# EAGLE design rocket-logger-basic (EAGLE 6.5.0)
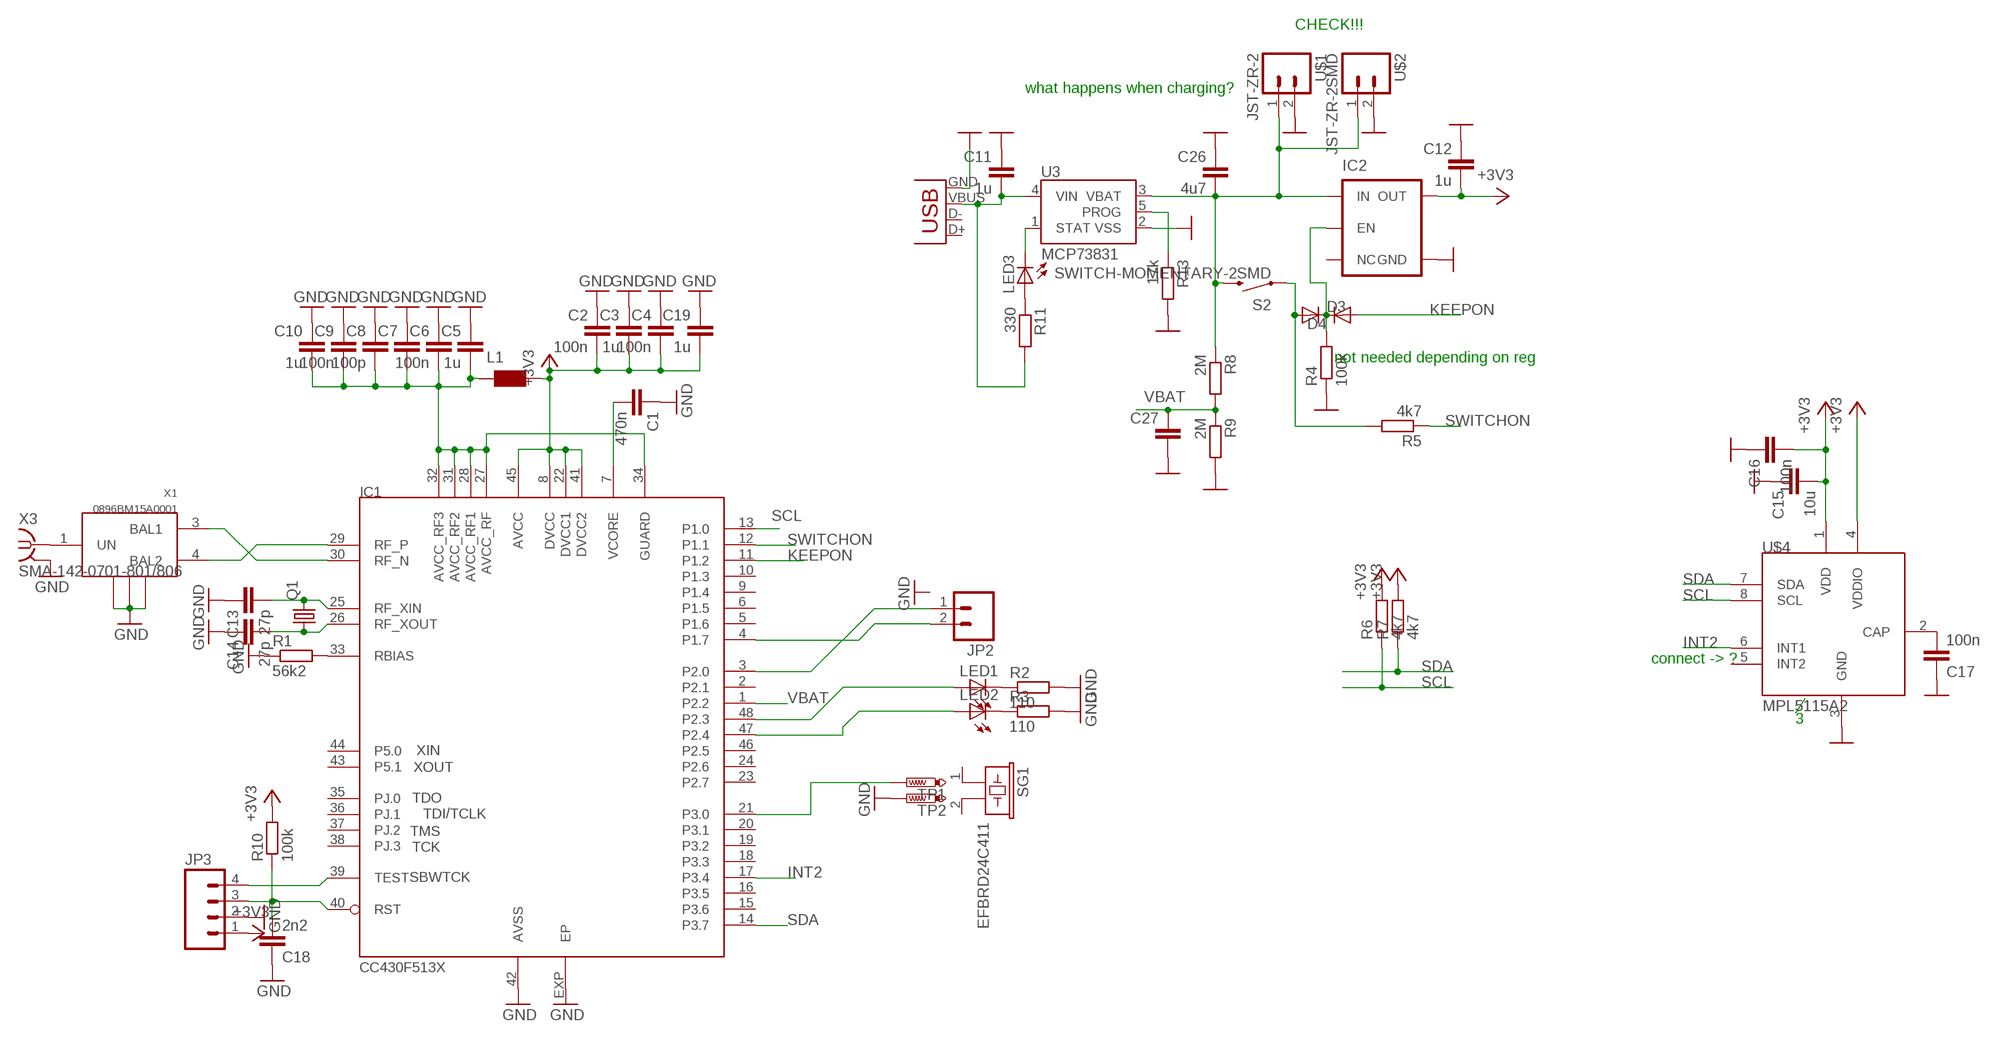
[diagram p0: schematic, sheet 1]

## Parts
C1  470n  C-EUC0402  [C0402]
C2  100n  C-EUC0402  [C0402]
C3  1u  C-EUC0402  [C0402]
C4  100n  C-EUC0402  [C0402]
C5  1u  C-EUC0402  [C0402]
C6  100n  C-EUC0402  [C0402]
C7  C-EUC0402  [C0402]
C8  100p  C-EUC0402  [C0402]
C9  100n  C-EUC0402  [C0402]
C10  1u  C-EUC0402  [C0402]
C11  1u  C-EUC0402  [C0402]
C12  1u  C-EUC0402  [C0402]
C13  27p  C-EUC0402  [C0402]
C14  27p  C-EUC0402  [C0402]
C15  10u  C-EUC0402  [C0402]
C16  100n  C-EUC0402  [C0402]
C17  100n  C-EUC0402  [C0402]
C18  2n2  C-EUC0402  [C0402]
C19  1u  C-EUC0402  [C0402]
C26  4u7  C-EUC0402  [C0402]
C27  C-EUC0402  [C0402]
D3  DIODE-SOD523  [SOD523]
D4  DIODE-SOD523  [SOD523]
IC1  CC430F513X  [QFN48]
IC2  V_REG_TPS76433SOT23-5  [SOT23-5]
JP2  M02PTH  [1X02]
JP3  M04PTH  [1X04]
L1  WE-MK_0603  [0603]
LED1  LED0603  [LED-0603]
LED2  LED0603  [LED-0603]
LED3  LED0603  [LED-0603]
Q1  CRYSTAL5X3  [CRYSTAL-SMD-5X3]
R1  56k2  R-EU_R0402  [R0402]
R2  110  R-EU_R0402  [R0402]
R3  110  R-EU_R0402  [R0402]
R4  100k  R-EU_R0402  [R0402]
R5  4k7  R-EU_R0402  [R0402]
R6  4k7  R-EU_R0402  [R0402]
R7  4k7  R-EU_R0402  [R0402]
R8  2M  R-EU_R0402  [R0402]
R9  2M  R-EU_R0402  [R0402]
R10  100k  R-EU_R0402  [R0402]
R11  330  R-EU_R0402  [R0402]
R13  17k  R-EU_R0402  [R0402]
S2  SWITCH-MOMENTARY-2SMD  [TACTILE_SWITCH_SMD]
SG1  EFBRD24C411  [EFBRD24C411]
TP1  PTR1B1,27  [B1,27]
TP2  PTR1B1,27  [B1,27]
U3  MCP73831  [SOT23-5]
U$1  JST-ZR-2  [JST-ZR-2]
U$2  JST-ZR-2SMD  [JST-ZR-2-SMD]
U$4  MPL5115A2  [LGA8]
X1  0896BM15A0001  [0896BM15A0001]
X2  USB-MICROB  [USB-MICROB]
X3  SMA-142-0701-801/806  [J502-ND-142-0701-801/806]

## Nets
+3V3: C2.2 C3.2 C4.2 C12.2 C15.2 C16.2 C19.2 IC1.8(DVCC) IC1.22(DVCC1) IC1.41(DVCC2) IC1.45(AVCC) IC2.5(OUT) JP3.1 L1.2 R6.2 R7.2 R10.2 U$4.1(VDD) U$4.4(VDDIO)
AVCC_RF2: C5.2 C6.2 C7.2 C8.2 C9.2 C10.2 IC1.27(AVCC_RF) IC1.28(AVCC_RF1) IC1.31(AVCC_RF2) IC1.32(AVCC_RF3) IC1.34(GUARD) L1.1
GND: C1.1 C2.1 C3.1 C4.1 C5.1 C6.1 C7.1 C8.1 C9.1 C10.1 C11.1 C12.1 C13.1 C14.1 C15.1 C16.1 C17.1 C18.1 C19.1 C26.1 C27.2 IC1.42(AVSS) IC1.EXP(EP) IC2.2(GND) JP3.2 R1.1 R2.2 R3.2 R4.1 R9.2 R13.2 TP2.TP U3.2(VSS) U$1.2 U$2.2 U$4.3(GND) X1.2(GND2) X1.5(GND) X1.6(GND1) X2.GND X3.G@1(GND)
INT2: IC1.17(P3.4) U$4.6(INT1)
KEEPON: D4.A IC1.11(P1.2)
N$1: R13.1 U3.5(PROG)
N$2: C26.2 IC2.1(IN) R8.1 S2.3 U3.3(VBAT) U$1.1 U$2.1
N$3: IC1.30(RF_N) X1.3(BAL1)
N$4: IC1.29(RF_P) X1.4(BAL2)
N$5: IC1.33(RBIAS) R1.2
N$6: C13.2 IC1.25(RF_XIN) Q1.3
N$7: C14.2 IC1.26(RF_XOUT) Q1.1
N$8: X1.1(UN) X3.1
N$9: LED1.C R2.1
N$10: LED2.C R3.1
N$11: IC1.3(P2.0) JP2.1
N$12: IC1.4(P1.7) JP2.2
N$13: C17.2 U$4.2(CAP)
N$15: LED3.A R11.1
N$16: IC1.48(P2.3) LED1.A
N$18: C11.2 R11.2 U3.4(VIN) X2.VBUS
N$19: LED3.C U3.1(STAT)
N$23: IC1.39(TEST) JP3.4
N$24: D3.A R5.2 S2.1
N$25: D3.C D4.C IC2.3(EN) R4.2
N$26: C18.2 IC1.40(RST) JP3.3 R10.1
N$28: IC1.47(P2.4) LED2.A
N$29: IC1.21(P3.0) TP1.TP
SCL: IC1.13(P1.0) R6.1 U$4.8(SCL)
SDA: IC1.14(P3.7) R7.1 U$4.7(SDA)
SWITCHON: IC1.12(P1.1) R5.1
VBAT: C27.1 IC1.1(P2.2) R8.2 R9.1
VCORE: C1.2 IC1.7(VCORE)
Unconnected: IC1.2(P2.1) IC1.5(P1.6) IC1.6(P1.5) IC1.9(P1.4) IC1.10(P1.3) IC1.15(P3.6) IC1.16(P3.5) IC1.18(P3.3) IC1.19(P3.2) IC1.20(P3.1) IC1.23(P2.7) IC1.24(P2.6) IC1.35(PJ.0) IC1.36(PJ.1) IC1.37(PJ.2) IC1.38(PJ.3) IC1.43(P5.1) IC1.44(P5.0) IC1.46(P2.5) IC2.4(NC) SG1.1 SG1.2 U$4.5(INT2) X2.D+ X2.D-

## Notes on the sheet
- CHECK!!!
- what happens when charging?
- not needed depending on reg
- connect -> ?
- 3

## Power pins joined to a net without a drawn wire
GND: X3.G@2(GND) X3.G@3(GND) X3.G@4(GND)

## Library data of the parts
C1-C19 C26 C27 = resistor:C-EU: CAPACITOR, European symbol
D3 D4 = diode:DIODE-: DIODE
IC1 = Mine:CC430F513X
IC2 = SparkFun:V_REG_TPS76433: Voltage Regulator Older TI part. LDO 150mA regulator. No output by-pass cap option. See V_REG_LDO for a better part.
JP2 = SparkFun:M02: Header 2 Standard 2-pin 0.1" header. Use with straight break away headers (SKU : PRT-00116), right angle break away headers (PRT-00553), swiss pins (PRT-00743), machine pins (PRT-00117), and female headers (PRT-00115). Molex polarized connector foot print use with SKU : PRT-08233 with associated crimp pins and housings.
JP3 = SparkFun:M04: Header 4 Standard 4-pin 0.1" header. Use with straight break away headers (SKU : PRT-00116), right angle break away headers (PRT-00553), swiss pins (PRT-00743), machine pins (PRT-00117), and female headers (PRT-00115). Molex polarized connector foot print use with SKU : PRT-08231 with associated crimp pins and housings.
L1 = wuerth-elektronik:WE-MK: SMD Multilayer Ceramic Inductors WE-MK - Windings printed on ceramic substrate - Extremely high SRF > 15 GHz - Inductance is stable over temperature -- High frequency circuits -- Bluetooth -- Wireless LAN -- Filter circuits
LED1-LED3 = SparkFun:LED: LEDs Standard schematic elements and footprints for 5mm, 3mm, 1206, and 0603 sized LEDs. 5mm - Spark Fun Electronics SKU : COM-00529 (and others)
Q1 = SparkFun:CRYSTAL: Crystals Various standard crystals. Proven footprints. Spark Fun Electronics SKU : COM-00534
R1-R11 R13 = rcl:R-EU_: RESISTOR, European symbol
S2 = SparkFun:SWITCH-MOMENTARY-2
SG1 = buzzer:EFB?: Piezoelectric Acoustic Transducer Source: Panbasonic .. 2SC1685.pdf; OC_FARNELL: unknown; OC_NEWARK: unknown
TP1 TP2 = testpad:PTR1: TEST PIN
U3 = SparkFun-PowerIC:MCP73831: Miniature single cell, fully integrated Li-Ion, Li-polymer charge management controller http://ww1.microchip.com/downloads/en/DeviceDoc/21984a.pdf IC-09995; PROD_ID: IC-09995
U$1 U$2 = Mine:JST-ZR-2
U$4 = Mine:MPL5115A2
X1 = Mine:0896BM15A0001
X2 = SparkFun:USB: USB Connectors USB-B-PTH is fully proven SKU : PRT-00139 USB-miniB is fully proven SKU : PRT-00587 USB-A-PCB is untested. USB-A-H is throughly reviewed, but untested. Spark Fun Electronics SKU : PRT-00437 USB-B-SMT is throughly reviewed, but untested. Needs silkscreen touching up. USB-A-S has not been used/tested USB-MB-H has not been used/tested
X3 = con-coax:SMA-: SMA 50 Ohm End Launch Jack Receptacle - Round Contact Johnson Components Source: www.johnsoncomponents.com .. J502-ND.pdf; MF: JOHNSON COMPONENTS; MPN: 142-0701-801; OC_FARNELL: 1608592; OC_NEWARK: 90F2624

## Board
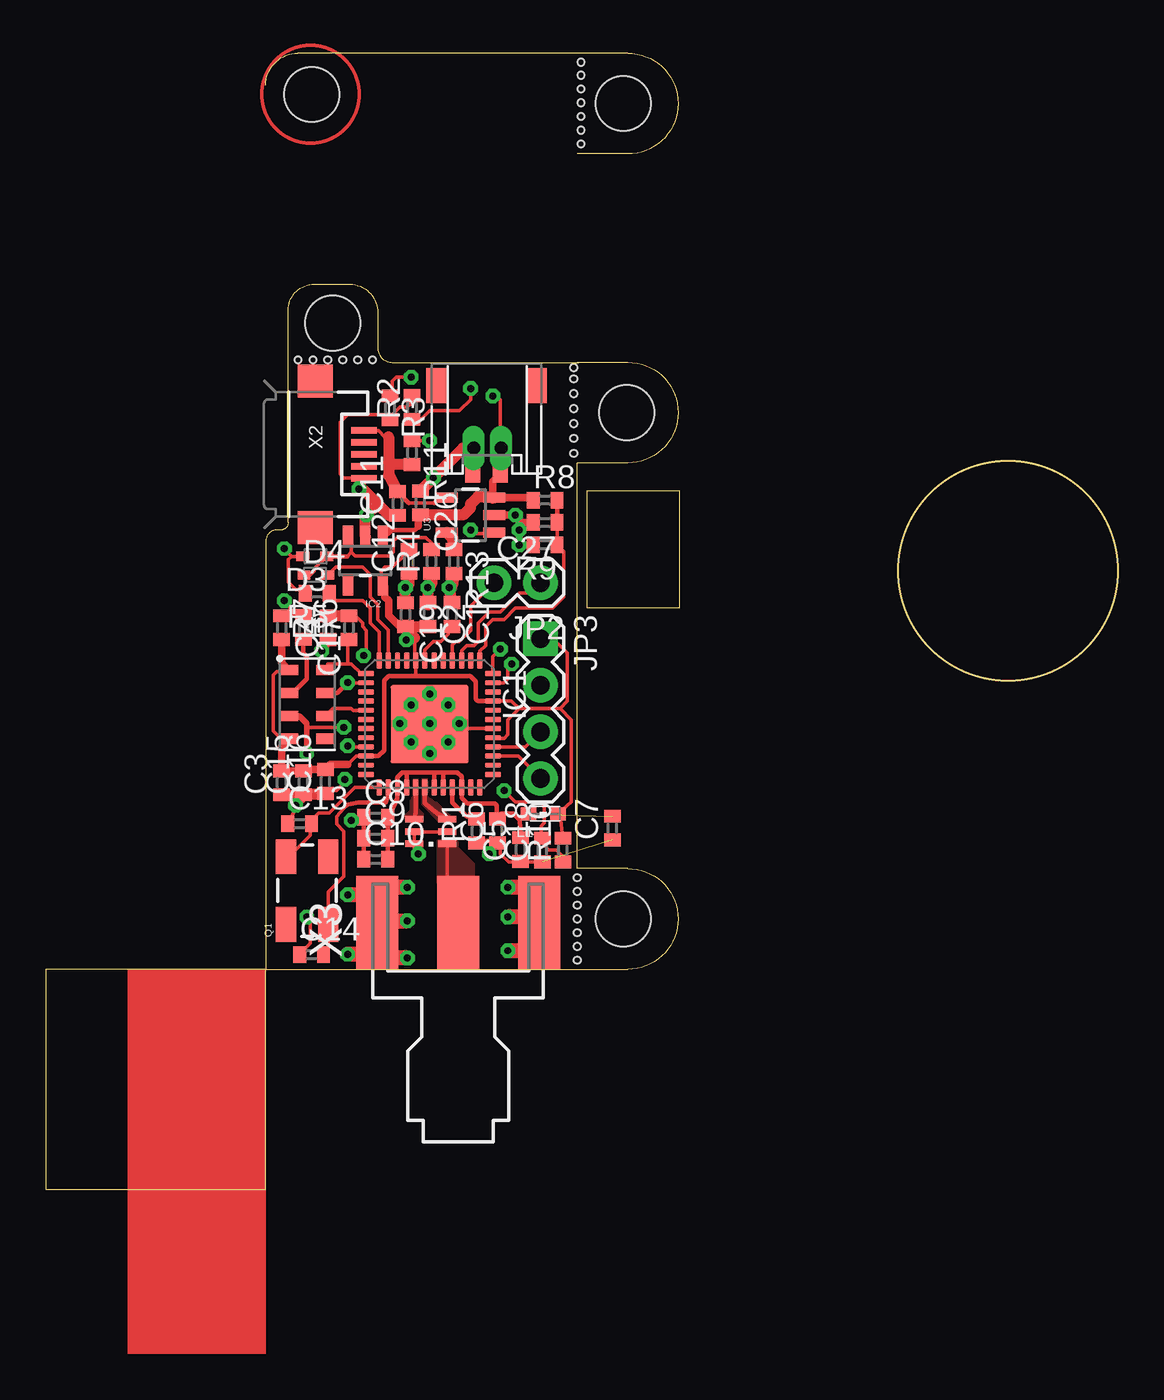
[diagram p1: board, top side]
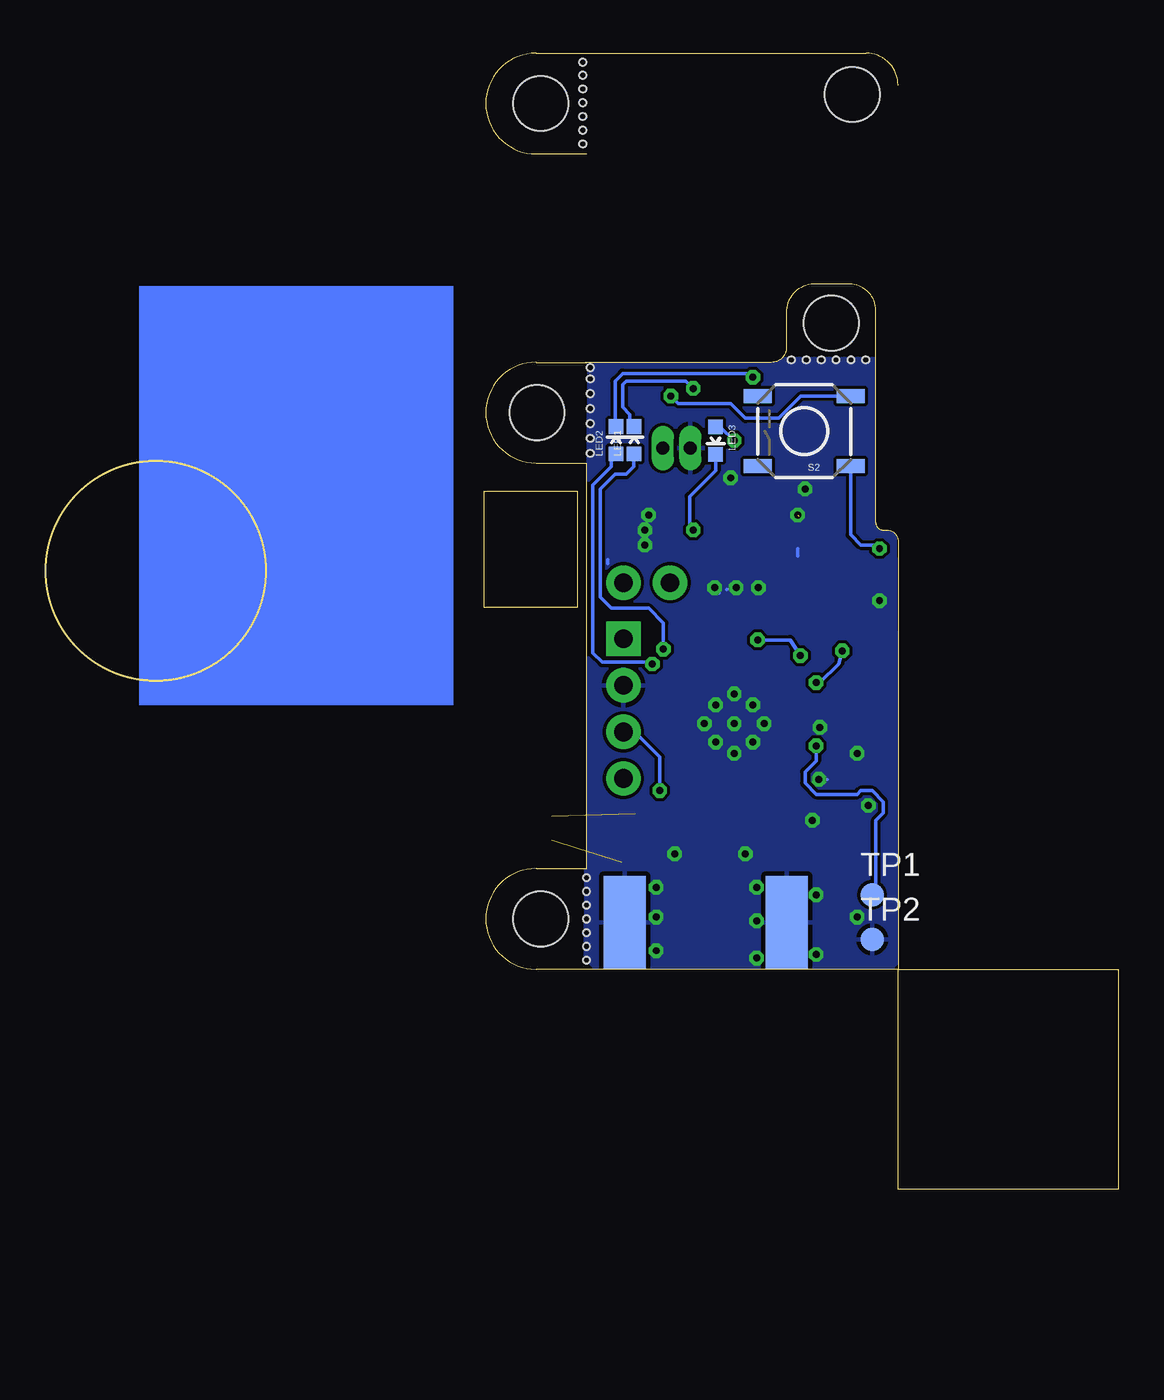
[diagram p2: board, bottom side, seen from below]

Size 58.5 x 62 mm. Coordinates in mm from the lower left corner, seen from the top.
Outline: 29,56.5 31.75,56.5 arc90 34.5,59.25 arc90 31.75,62 13.75,62 arc90 12,60.25
Outline: 29.07,45.12 18.91,45.12 arc-90 18.1,45.93 18.1,47.97 arc90 16.47,49.39 14.64,49.39 arc90 13.22,47.97 13.22,36.38 arc-90 12.81,35.98 12.61,35.98 arc90 12,35.37 12,12 31.75,12 arc90 34.5,14.75 arc90 31.75,17.5 29,17.5 29,39.63 31.75,39.63 arc90 34.5,42.38 arc90 31.75,45.13
Outline: 31.75,45.12 29,45.12
Outline: circle at 52.5,33.75 radius 6
Copper layers (1*16): Top 0.035mm / dielectric 1.5mm / Bottom 0.035mm
Design rules "default": minimum track width 7mil, minimum drill 12mil, track to track 7mil, track to pad 7mil, pad to pad 7mil, via to via 7mil, smd to smd 2mil, copper to edge 1mil, drill to drill 8mil, minimum pad ring 10mil, minimum via ring 8mil, stop-mask expansion 4mil, vias tented up to drill 0mil, thermal gap 10mil
Holes 3 mm at 14.5,59.75 31.5,14.75 31.5,59.25 15.65,47.26 31.7,42.38
Holes 0.38 mm at 29.2,57.05 29.2,57.8 29.2,58.55 29.2,59.3 29.2,60.05 29.2,60.8 29.2,61.5 29,17 29,16.25 29,15.5 29,14.75 29,14 29,13.25 29,12.5 17.82,45.26 17.01,45.26 16.2,45.26 15.39,45.26 14.57,45.26 13.76,45.26 28.8,44.84 28.8,44.23 28.8,43.42 28.8,42.6 28.8,41.79 28.8,40.98 28.8,40.16

### Footprints (pad centres in the part's own frame; a part is rotated, then mirrored left to right if it is on the bottom)
C0402 = smd 0.7 x 0.9: 1 -0.65,0; 2 0.65,0
SOD523 = smd 0.7 x 0.5: A 0.7,0; C -0.6,0
QFN48 = smd 0.9 x 0.3: 1 -3.462,2.75; 2 -3.462,2.25; 3 -3.462,1.75; 4 -3.462,1.25; 5 -3.462,0.75; 6 -3.462,0.25; 7 -3.462,-0.25; 8 -3.462,-0.75; 9 -3.462,-1.25; 10 -3.462,-1.75; 11 -3.462,-2.25; 12 -3.462,-2.75; 25 3.462,-2.75; 26 3.462,-2.25; 27 3.462,-1.75; 28 3.462,-1.25; 29 3.462,-0.75; 30 3.462,-0.25; 31 3.462,0.25; 32 3.462,0.75; 33 3.462,1.25; 34 3.462,1.75; 35 3.462,2.25; 36 3.462,2.75 | smd 0.3 x 0.9: 13 -2.75,-3.462; 14 -2.25,-3.462; 15 -1.75,-3.462; 16 -1.25,-3.462; 17 -0.75,-3.462; 18 -0.25,-3.462; 19 0.25,-3.462; 20 0.75,-3.462; 21 1.25,-3.462; 22 1.75,-3.462; 23 2.25,-3.462; 24 2.75,-3.462; 37 2.75,3.462; 38 2.25,3.462; 39 1.75,3.462; 40 1.25,3.462; 41 0.75,3.462; 42 0.25,3.462; 43 -0.25,3.462; 44 -0.75,3.462; 45 -1.25,3.462; 46 -1.75,3.462; 47 -2.25,3.462; 48 -2.75,3.462 | smd 4.25 x 4.25: EXP 0,0
SOT23-5 = smd 0.55 x 1.2: 1 -0.95,-1.3; 2 0,-1.3; 3 0.95,-1.3; 4 0.95,1.3; 5 -0.95,1.3
1X02 = drill 1.016 pad 1.88: 1 0,0; 2 2.54,0
1X04 = drill 1.016 pad 1.88 square: 1 0,0 | drill 1.016 pad 1.88: 2 2.54,0; 3 5.08,0; 4 7.62,0
0603 = smd 0.85 x 0.7: 1 -0.9,0; 2 0.7,0
LED-0603 = smd 0.8 x 0.8: A 0,-0.75; C 0,0.75
CRYSTAL-SMD-5X3 = smd 1.9 x 1.1: 1 -1.85,-1.15; 2 1.85,-1.15; 3 1.85,1.15; 4 -1.85,1.15
R0402 = smd 0.7 x 0.9: 1 -0.65,0; 2 0.65,0
TACTILE_SWITCH_SMD = smd 1.524 x 0.762: 1 -2.54,1.905; 2 2.54,1.905; 3 -2.54,-1.905; 4 2.54,-1.905
EFBRD24C411 = drill 1.1 pad 1.676: 1 -5,0; 2 5,0
B1,27 = smd 1.27 x 1.27: TP 0,0
JST-ZR-2 = drill 0.7 pad 1.016 long: 1 0.75,0; 2 -0.75,0
JST-ZR-2-SMD = smd 0.8 x 2.2: 1 0.6,-1.1; 2 -0.9,-1.1 | smd 1.1 x 1.9: TB1 -2.9,3.1; TB2 2.6,3.1
LGA8 = smd 1 x 0.55: 1 -1,1.875; 2 -1,0.625; 3 -1,-0.625; 4 -1,-1.875; 5 1,-1.875; 6 1,-0.625; 7 1,0.625; 8 1,1.875
0896BM15A0001 = smd 0.35 x 1: 1 0.65,0.9; 2 0,0.9; 3 -0.7,0.9; 4 -0.7,-0.9; 5 0,-0.9; 6 0.65,-0.9
USB-MICROB = smd 0.35 x 1.4: D+ 0,2.65; D- -0.65,2.65; GND 1.3,2.65; ID 0.65,2.65; VBUS -1.3,2.65 | smd 1.8 x 1.9: MT1 -4,0; MT2 4,0
J502-ND-142-0701-801/806 = smd 5.08 x 2.286: 1 2.565,0; G@1 2.565,4.42; G@2 2.565,-4.42 | smd 5.08 x 2.286 bottom: G@3 2.565,4.42; G@4 2.565,-4.42

### Placement (x,y rotation side)
C1  22.16,31.36 270 top
C2  20.86,31.36 270 top
C3  12.86,22.17 90 top
C4  12.87,30.64 270 top
C5  25.9,18.53 90 top
C6  24.65,19.55 90 top
C7  30.91,19.7 90 top
C8  18,20.3 0 top
C9  18,19.15 0 top
C10  18,18 0 top
C11  19.18,37.43 90 top
C12  19.81,34.27 90 top
C13  13.84,19.95 0 top
C14  14.5,12.8 0 top
C15  14.05,22.17 90 top
C16  15.25,22.25 90 top
C17  14.06,30.66 270 top
C18  27.09,18.5 90 top
C19  19.62,31.35 270 top
C26  20.43,37.45 270 top
C27  27.24,36.38 180 top
D3  14.72,34.54 180 top
D4  14.69,33.52 0 top
IC1  20.93,25.38 270 top
IC2  17.43,34.31 180 top
JP2  26.98,33.1 180 top
JP3  26.99,30.03 270 top
L1  27.24,20.48 0 top
LED1  26.4,40.87 0 bottom
LED2  27.4,40.87 0 bottom
LED3  21.96,40.85 180 bottom
Q1  14.25,16.3 90 top
R1  23.5,19.55 90 top
R2  19.97,42.66 90 top
R3  18.78,42.65 270 top
R4  21.05,34.27 90 top
R5  14.8,32.53 180 top
R6  16.54,30.64 90 top
R7  15.39,30.64 90 top
R8  27.24,37.6 0 top
R9  27.24,35.16 180 top
R10  28.21,18.5 90 top
R11  19.98,40.19 270 top
R13  22.26,34.25 270 top
S2  17.13,41.37 180 bottom
SG1  12.25,-39 0 top  (outside the outline)
TP1  13.42,16.06 0 bottom
TP2  13.42,13.63 0 bottom
U3  23.18,36.79 90 top
U$1  24.09,40.45 0 top
U$2  24.19,40.75 0 top
U$4  14.26,26.46 0 top
X1  21,19.5 270 top
X2  14.7,40.1 270 top
X3  22.5,12 90 top

### Tracks (layer width: path | path; a pad name or v marks a point on that pad's centre or on a via)
+3V3  (via drill 0.38)
  Top 0.203: IC1.22 16.93,23.63 16.47,23.18 | U$4.4 13.22,24.75 12.66,24.75 12.41,25.01 12.41,28.05 12.61,28.26 13.18,28.26 U$4.1 | 20.18,28.02 IC1.8 20.13,28.71 20.13,29.88 20.03,29.98 v19.67,29.98 19.72,30.03 | IC1.45 25.41,26.63 25.82,26.22 | 25.82,26.22 28.05,26.22 | 28.05,26.22 28.66,25.61 28.66,21.14 28.46,20.94 L1.2 28.05,20.42 R10.2 | 25.82,26.22 25.21,25.61 25.21,24.8 25.01,24.6 24.43,24.6 IC1.41 | JP3.1 27.7,30.03 28.46,29.27 28.46,26.63 28.05,26.22 | IC2.5 18.43,33.21 | 18.45,33.28 IC2.5 | 16.35,31.3 R6.2 16.89,31.29 17.28,30.9 17.28,30.69 17.49,30.49 17.49,29.27 v17.33,29.12 | C12.2 19.6,34.84 19.6,34.64 18.91,33.95 18.5,33.95 18.3,33.74 18.3,33.09 IC2.5
  Top 0.254: IC1.22 18.13,23.63 18.45,23.95 18.45,27.75 18.7,28 20,28 | 20,28 23.16,28 23.45,27.7 23.45,26.75 23.57,26.63 IC1.45 | 20.18,28.02 20,28
  Top 0.406: 19.33,30.69 C19.2 19.3,30.69 19.3,30.7 18.71,31.3 18.71,32.12 18.5,32.32 18.5,32.89 IC2.5 | C4.2 12.87,28.72 U$4.1 | 16.47,23.18 15.53,23.18 C16.2 14.13,22.9 C15.2 C3.2 12.86,24.19 U$4.4
  Top 0.61: C2.2 C19.2 19.62,30.59 20.13,30.09 19.77,30.09 v19.67,29.98 | R7.2 R6.2
  Bottom 0.203: v19.67,29.98 17.89,29.98 v17.33,29.12
AVCC_RF2  (1 unrouted)
  Top 0.203: L1.1 26.23,20.53 25.85,20.15
  Top 0.254: C10.2 C9.2 C8.2 19.18,21.28 IC1.27 19.18,22.48 19.45,22.75 19.5,22.75 | 19.5,22.75 21,22.75 | 21,22.75 21.7,22.75 | 21.7,22.75 22.45,22.75 22.68,22.52 IC1.34 22.68,21.36 23,21.05 24.49,21.05 24.6,20.94 24.6,20.25 C6.2 24.85,20.5 25.5,20.5 25.85,20.15 C5.2 | IC1.31 21.18,22.73 21,22.75 | IC1.32 21.68,22.73 21.7,22.75 | IC1.28 19.68,22.73 19.5,22.75
GND  (via drill 0.38)  (2 unrouted)
  Top 0.203: C15.1 14.05,21.16 v13.63,20.94 13.6,20.71 C13.1 | 13.62,31.31 13.25,31.31 C4.1 13.61,31.5 | 14.23,31.4 C17.1 13.62,31.31 | v16.27,25.21 14.23,25.21 | v20.94,25.41 20.94,25.39 IC1.EXP 21.18,25.13 IC1.42 | R9.2 v25.82,35.16 | C18.1 26.02,17.85 | 26.02,17.85 C5.1 | 26.02,17.85 25.25,17.85 24.8,18.3 24.8,19.05 C6.1 | R1.1 23.59,19.1 v24.19,18.3 | X1.5 X1.6 | X1.2 X1.5 | X1.5 20.1,18.53 v20.33,18.3 | C8.1 17.25,20.5 v16.67,20.13 | 13.62,31.31 v13.02,32.12 | C14.1 13.85,12.83 14.44,13.42 14.44,14.64 v14.23,14.85 | U$2.2 23.29,40.4 U$1.2 | v16.32,22.36 16.32,22.21 15.86,21.75 15.4,21.75 C16.1 | X2.GND 17.34,38.82 16.27,38.82 16.06,39.03 16.06,41.87 16.47,42.28 18.5,42.28 R3.2 | 18.83,42.05 18.83,42.2 19.32,42.68 19.72,42.68 19.93,42.89 19.93,43.27 R2.2
  Top 0.254: C8.1 C9.1 C10.1 | R1.1 23.5,19 24.65,19 C6.1 | X2.GND 17.35,38.49 v17.08,38.21
  Top 0.305: v14.23,23.79 14.23,25.21 14.23,25.41 13.83,25.82 13.27,25.82 U$4.3
  Top 0.406: U3.2 v25.61,36.79 25.82,36.59 25.82,36.18 | 25.82,36.18 v25.82,35.16 | C27.2 26.02,36.38 25.82,36.18
  Top 0.61: 17.35,38.14 18.1,37.4 | 18.1,37.4 18.72,36.78 C11.1 | IC2.2 17.43,36.74 18.1,37.4 | C3.1 C15.1 | C16.1 15.1,21.6 15.05,21.55 14.03,21.55 | U$1.2 22.77,40.45 v21.14,38.82 20.43,38.11 C26.1 | 18.83,42.05 R3.2 | R13.2 22.21,33.03 v22.01,32.83 | C1.1 v22.01,32.82 | R4.1 21.05,33.03 v20.84,32.83 20.86,32.8 C2.1 | C12.1 19.81,33.01 v19.62,32.83 C19.1
  Top 0.813: v22.01,32.82 v22.01,32.83 | C2.1 | v19.72,16.47 18.71,16.47 | 18.91,14.64 18.71,14.64 | v19.72,12.61 18.71,12.61 | 17.49,16.06 v16.47,16.06 | 17.49,12.81 v16.47,12.81 | 26.22,16.47 v25.21,16.47 | 26.22,13.02 v25.21,13.02 | 26.22,14.85 26.02,14.85 | X3.G@1 18.83,14.56 18.91,14.64 | 18.91,14.64 v19.72,14.64 | X3.G@4 26.3,14.56 26.02,14.85 | 26.02,14.85 v25.21,14.85
  Bottom 0.203: 27.85,34.35 27.85,34.15 | v13.63,20.94 13.83,20.74 | v16.32,22.36 15.86,22.36 | v22.01,32.83 21.75,32.52 | v20.84,32.83 21.35,32.73 | v25.82,35.16 25.61,35.37 | v24.19,18.3 24.19,18.1 | v20.33,18.3 20.33,18.1 | 17.49,34.96 17.49,34.55
  other vias: 17.49,36.79 21.96,26.43 19.92,26.43 21.96,24.4 19.92,24.4 20.94,23.79 22.57,25.41 20.94,27.04 19.32,25.41 25.82,35.98
  pour Bottom: 13.02,45.32 28.46,45.32 28.87,44.92 29.07,12.61 28.46,12 12.41,12 12,12.41 12.2,44.51
INT2
  Top 0.203: IC1.17 16.76,26.13 16.67,26.22 15.65,26.22 U$4.6
KEEPON
  Top 0.203: IC1.11 18.68,30.51 18.1,31.1 18.1,31.91 17.69,32.32 17.69,33.54 17.28,33.95 15.81,33.95 D4.A
N$1
  Top 0.61: R13.1 22.21,35.51 U3.5
N$2  (via drill 0.38)
  Top 0.203: 24.88,40.37 24.8,40.45 U$1.1 | U$2.1 24.79,40.4 U$1.1 | v24.39,43.29 24.6,43.29 24.8,43.09 24.8,40.49 U$1.1 | R8.1 26.59,37.56 26.53,37.5
  Top 0.254: 18.75,35.98 20.13,35.98 20.33,36.18
  Top 0.406: 18.38,35.66 IC2.1 18.75,35.98 | U$2.1 24.8,39.64 24.8,39.03 24.39,38.62 24.39,37.62 U3.3 26.29,37.74 26.53,37.5 26.63,37.4 | 20.33,36.18 20.33,36.7 C26.2
  Top 0.61: U3.3 24.41,37.81 23.58,37.81 23.18,37.4 23.18,37.2 22.77,36.79 20.44,36.79 C26.2
  Bottom 0.203: v24.39,43.29 23.99,42.89 21.14,42.89 20.33,42.07 18.5,42.07 17.3,43.27 S2.3
N$3
  Top 0.254: IC1.30 20.68,21.07 20.75,21 21.35,20.5 X1.3
  pour Top (no thermals): 20.53,22.36 20.84,22.36 20.84,21.4 21.19,21.04 21.3,21.04 21.96,20.38 22.11,20.13 21.45,20.13 20.59,20.99 20.59,22.01
N$4
  Top 0.254: IC1.29 20.18,20.57 X1.4
  pour Top (rank 2, no thermals): 20.53,20.13 20.53,20.84 20.38,20.99 20.38,22.26 20.33,22.31 20.08,22.31 20.03,22.26 20.03,21.3 19.92,21.19 19.92,20.64 19.67,20.38 19.67,20.18 19.77,20.13
N$5
  Top 0.254: IC1.33 22.18,21.11 22.95,20.34 23.56,20.34 R1.2
N$6
  Top 0.203: Q1.3 13.47,18.35 14.44,19.32 14.44,19.89 C13.2 14.49,20.15 14.88,20.53 15.45,20.53 16.84,21.92 IC1.25
N$7
  Top 0.203: C14.2 15.4,13.25 Q1.1 15.4,16.21 16.27,17.08 16.27,19.52 15.86,19.93 15.86,20.33 16.24,20.74 16.5,21
  Top 0.254: IC1.26 18.68,21.48 18.55,21.1 17.05,21.1 16.5,21
N$8
  Top 0.203: X1.1 21.9,16.73 22.36,16.27 22.36,14.7 X3.1
  pour Top (no thermals): 21.4,19.01 22.36,19.01 22.41,18.96 22.41,18.65 23.33,17.74 23.33,16.72 21.4,16.72
N$9  (via drill 0.38)
  Top 0.203: v23.18,43.7 23.18,43.09 22.57,42.48 20.94,42.48 20.48,42.02 R2.1
  Bottom 0.203: 26.4,41.85 LED1.C 26.63,41.85 26.63,42.28 27.04,42.68 27.04,43.9 26.83,44.11 23.58,44.11 v23.18,43.7
N$10  (via drill 0.38)
  Top 0.203: v19.93,44.31 19.11,44.31 18.91,44.11 18.91,43.23 R3.1
  Bottom 0.203: v19.93,44.31 20.13,44.51 27.04,44.51 27.44,44.11 27.44,41.67 LED2.C
N$11
  Top 0.203: IC1.3 22.68,29.39 22.97,29.68 23.38,29.68 23.58,29.88 23.58,30.9 24.19,31.51 24.8,31.51 25.82,32.52 26.41,32.52 JP2.1
N$12
  Top 0.203: IC1.4 22.18,29.7 22.36,29.88 22.57,29.88 23.18,30.49 23.18,31.83 JP2.2
N$13
  Top 0.254: U$4.2 13.47,27.08 14.23,27.85 14.23,29.07 14.03,29.27 14.03,29.95 C17.2
N$15  (via drill 0.38)
  Top 0.203: R11.1 20.55,40.84 v20.94,40.85
  Bottom 0.203: LED3.A 21.69,41.6 v20.94,40.85
N$16  (via drill 0.38)
  Top 0.203: IC1.48 24.4,29.07 v24.8,29.48
  Bottom 0.203: v24.8,29.48 24.8,30.9 25.61,31.71 27.65,31.71 28.26,32.32 28.26,38.21 27.44,39.03 26.83,39.03 26.43,39.43 26.43,40.1 LED1.A
N$18
  Top 0.203: 17.29,41.46 X2.VBUS 18.16,41.41 18.5,41.06 18.71,41.06 | U3.4 21.62,37.74 21.55,37.81 | 21.19,37.45 19.81,37.45
  Top 0.254: 21.55,37.81 21.19,37.45 | 19.81,37.45 C11.2
  Top 0.61: 18.71,41.06 18.71,39.64 | 18.71,39.64 18.71,38.96 C11.2 19.24,38.08 19.32,38.01 | R11.2 18.8,39.54 18.71,39.64
N$19  (via drill 0.38)
  Top 0.203: v23.18,35.98 23.38,35.77 24.41,35.77 U3.1
  Bottom 0.203: LED3.C 21.96,39.23 23.38,37.81 23.38,36.18 v23.18,35.98
N$23
  Top 0.203: IC1.39 25.77,23.63 JP3.4
N$24  (via drill 0.38)
  Top 0.203: R5.2 14.03,32.53 13.83,32.73 13.63,32.73 13.22,33.13 13.22,34.35 13.41,34.54 | v13.02,34.96 13.02,34.93 13.41,34.54 | D3.A 13.41,34.54
  Bottom 0.203: S2.1 14.59,35.72 14.03,35.16 13.22,35.16 v13.02,34.96
N$25
  Top 0.203: 16.67,34.76 16.67,35.62 IC2.3 | 16.45,34.54 16.67,34.76 | D4.C 14.42,33.52 14.64,33.74 14.64,33.86 D3.C | 16.67,34.76 16.88,34.55 18.76,34.55 18.96,34.76 18.96,35.37 19.16,35.57 20.74,35.57 21.05,35.26 R4.2
  Top 0.254: 16.45,34.54 D3.C
N$26  (via drill 0.38)
  Top 0.203: v25.01,21.75 25.61,21.14 27.04,21.14 27.19,20.99 27.19,19.98 27.04,19.82 27.04,19.2 C18.2 27.24,19 27.24,18.71 27.44,18.5 27.85,18.5 28.2,18.15 R10.1 | IC1.40 26.17,24.13 JP3.3
  Bottom 0.203: v25.01,21.75 25.01,23.58 26.22,24.8 26.95,24.8 26.95,24.91 JP3.3
N$28  (via drill 0.38)
  Top 0.203: IC1.47 24.99,27.63 25.21,27.85 25.21,28.46 v25.41,28.66
  Bottom 0.203: v25.41,28.66 25.51,28.76 28.15,28.76 28.66,29.27 28.66,38.42 27.65,39.43 27.65,39.87 LED2.A
N$29  (via drill 0.38)
  Top 0.203: IC1.21 16.53,24.13 v16.47,24.19
  Bottom 0.203: TP1.TP 13.22,16.27 13.22,20.13 12.81,20.53 12.81,21.14 13.42,21.75 14.03,21.75 14.23,21.55 16.47,21.55 17.08,22.16 17.08,22.77 16.47,23.38 v16.47,24.19
SCL
  Top 0.203: 15.71,28.54 U$4.8 15.39,28.66 16.47,28.66 | IC1.13 17.2,28.14 16.67,28.66 16.47,28.66 | R6.1 16.54,29.75 16.47,29.68 16.47,28.66
SDA  (via drill 0.38)
  Top 0.203: R7.1 15.39,29.61 v15.05,29.37 | IC1.14 16.48,27.63 v16.47,27.65
  Top 0.254: U$4.7 15.91,27.08 v16.47,27.65
  Bottom 0.203: v15.05,29.37 15.25,28.66 16.27,27.65 v16.47,27.65
SWITCHON
  Top 0.203: IC1.12 18.18,30.4 17.69,30.9 17.69,31.71 17.28,32.12 15.66,32.12 15.46,32.32 R5.1
VBAT
  Top 0.203: C27.1 R9.1 28.26,34.8 28.26,32.32 27.65,31.71 25.61,31.71 25.01,31.1 24.39,31.1 23.99,30.69 23.99,29.68 23.68,29.37 IC1.1
  Top 0.254: R8.2 C27.1
VCORE
  Top 0.203: IC1.7 20.68,29.42 21.14,29.88 21.55,29.88 21.96,30.29 21.96,30.66 C1.2
(copper drawn outside any net)
  shapes: Bottom area x1, Top area x1, Top circle x1

### Text on the board
_tsilk: +
_bsilk: TOP | ACT | ON | CHG | PWR | ON/OFF | + | Rocket Altimeter | Matt Brejza | Jan 14 | Rev. 1